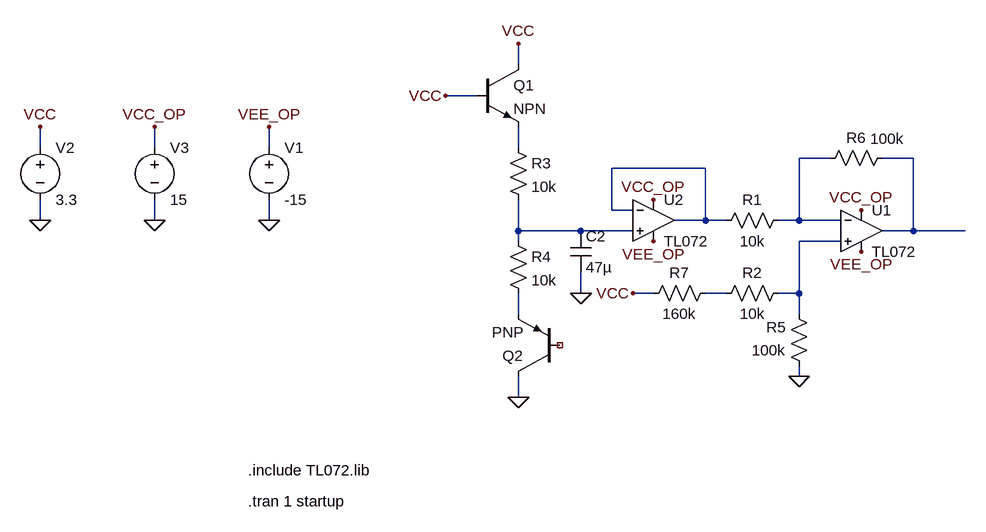
[diagram p0: schematic offset-smaller-r2r.asc]
offset-smaller-r2r.asc, the LTspice schematic file:
Version 4.1
SHEET 1 1828 680
WIRE 128 -176 128 -208
WIRE 64 -128 16 -128
WIRE -608 -48 -608 -80
WIRE -432 -48 -432 -80
WIRE -256 -48 -256 -80
WIRE 128 -48 128 -80
WIRE 608 -32 560 -32
WIRE 736 -32 688 -32
WIRE 416 -16 272 -16
WIRE 272 48 272 -16
WIRE 304 48 272 48
WIRE -608 64 -608 32
WIRE -432 64 -432 32
WIRE -256 64 -256 32
WIRE 416 64 416 -16
WIRE 416 64 368 64
WIRE 448 64 416 64
WIRE 560 64 560 -32
WIRE 560 64 528 64
WIRE 624 64 560 64
WIRE 128 80 128 32
WIRE 224 80 128 80
WIRE 304 80 224 80
WIRE 736 80 736 -32
WIRE 736 80 688 80
WIRE 816 80 736 80
WIRE 128 96 128 80
WIRE 624 96 560 96
WIRE 224 176 224 144
WIRE 336 176 304 176
WIRE 448 176 416 176
WIRE 560 176 560 96
WIRE 560 176 528 176
WIRE 128 208 128 176
WIRE 560 208 560 176
WIRE 560 304 560 288
WIRE 128 336 128 304
FLAG -256 64 0
FLAG -256 -80 VEE_OP
FLAG 224 176 0
FLAG 128 -208 VCC
FLAG 336 32 VCC_OP
FLAG 336 96 VEE_OP
FLAG 16 -128 VCC
FLAG 128 336 0
FLAG 656 48 VCC_OP
FLAG 656 112 VEE_OP
FLAG 560 304 0
FLAG 304 176 VCC
FLAG -608 64 0
FLAG -608 -80 VCC
FLAG -432 64 0
FLAG -432 -80 VCC_OP
SYMBOL voltage -256 -64 R0
WINDOW 123 0 0 Left 0
WINDOW 39 0 0 Left 0
SYMATTR InstName V1
SYMATTR Value -15
SYMBOL cap 208 80 R0
SYMATTR InstName C2
SYMATTR Value 47µ
SYMBOL res 112 -64 R0
SYMATTR InstName R3
SYMATTR Value 10k
SYMBOL res 112 80 R0
SYMATTR InstName R4
SYMATTR Value 10k
SYMBOL OpAmps\\opamp2 336 0 R0
SYMATTR InstName U2
SYMATTR Value TL072
SYMBOL npn 64 -176 R0
SYMATTR InstName Q1
SYMBOL pnp 192 304 R180
SYMATTR InstName Q2
SYMBOL res 544 48 R90
WINDOW 0 0 56 VBottom 2
WINDOW 3 32 56 VTop 2
SYMATTR InstName R1
SYMATTR Value 10k
SYMBOL res 544 160 R90
WINDOW 0 0 56 VBottom 2
WINDOW 3 32 56 VTop 2
SYMATTR InstName R2
SYMATTR Value 10k
SYMBOL res 576 304 R180
WINDOW 0 36 76 Left 2
WINDOW 3 36 40 Left 2
SYMATTR InstName R5
SYMATTR Value 100k
SYMBOL OpAmps\\opamp2 656 16 R0
SYMATTR InstName U1
SYMATTR Value TL072
SYMBOL res 704 -48 R90
WINDOW 0 0 56 VBottom 2
WINDOW 3 -29 8 VTop 2
SYMATTR InstName R6
SYMATTR Value 100k
SYMBOL res 432 160 R90
WINDOW 0 0 56 VBottom 2
WINDOW 3 32 56 VTop 2
SYMATTR InstName R7
SYMATTR Value 160k
SYMBOL voltage -608 -64 R0
WINDOW 123 0 0 Left 0
WINDOW 39 0 0 Left 0
SYMATTR InstName V2
SYMATTR Value 3.3
SYMBOL voltage -432 -64 R0
WINDOW 123 0 0 Left 0
WINDOW 39 0 0 Left 0
SYMATTR InstName V3
SYMATTR Value 15
TEXT -288 448 Left 2 !.include TL072.lib
TEXT -288 496 Left 2 !.tran 1 startup

The netlist it stands for:
* offset-smaller-r2r.asc
V1 VEE_OP 0 -15
C2 N005 0 47µ
R3 N001 N005 10k
R4 N005 N008 10k
X§U2 N005 N004 VCC_OP VEE_OP N004 TL072  ; pins In+ In- V+ V- OUT
Q1 VCC VCC N001 0 NPN
Q2 0 NC_01 N008 0 PNP
R1 N002 N004 10k
R2 N006 N007 10k
R5 0 N006 100k
X§U1 N006 N002 VCC_OP VEE_OP N003 TL072  ; pins In+ In- V+ V- OUT
R6 N003 N002 100k
R7 N007 VCC 160k
V2 VCC 0 3.3
V3 VCC_OP 0 15
.model NPN NPN
.model PNP PNP
.lib standard.bjt
.include TL072.lib
.tran 1 startup
.backanno
.end

* Results of the author's LTspice run, read from the files saved beside the schematic
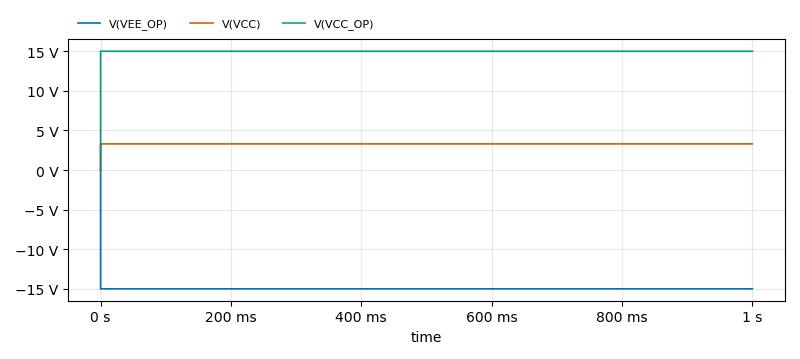
[diagram p1: Transient Analysis of offset-smaller-r2r.asc, plotted from the saved traces]
* Transient Analysis, 1 run:
*   V(VEE_OP): min -15 V, max 0 V, average -15 V, rms 15 V, last -15 V
*   V(VCC): min 0 V, max 3.3 V, average 3.3 V, rms 3.3 V, last 3.3 V
*   V(VCC_OP): min 0 V, max 15 V, average 15 V, rms 15 V, last 15 V